# EAGLE design OPEN_SPECTRO_PI_HAT (EAGLE 9.7.0)
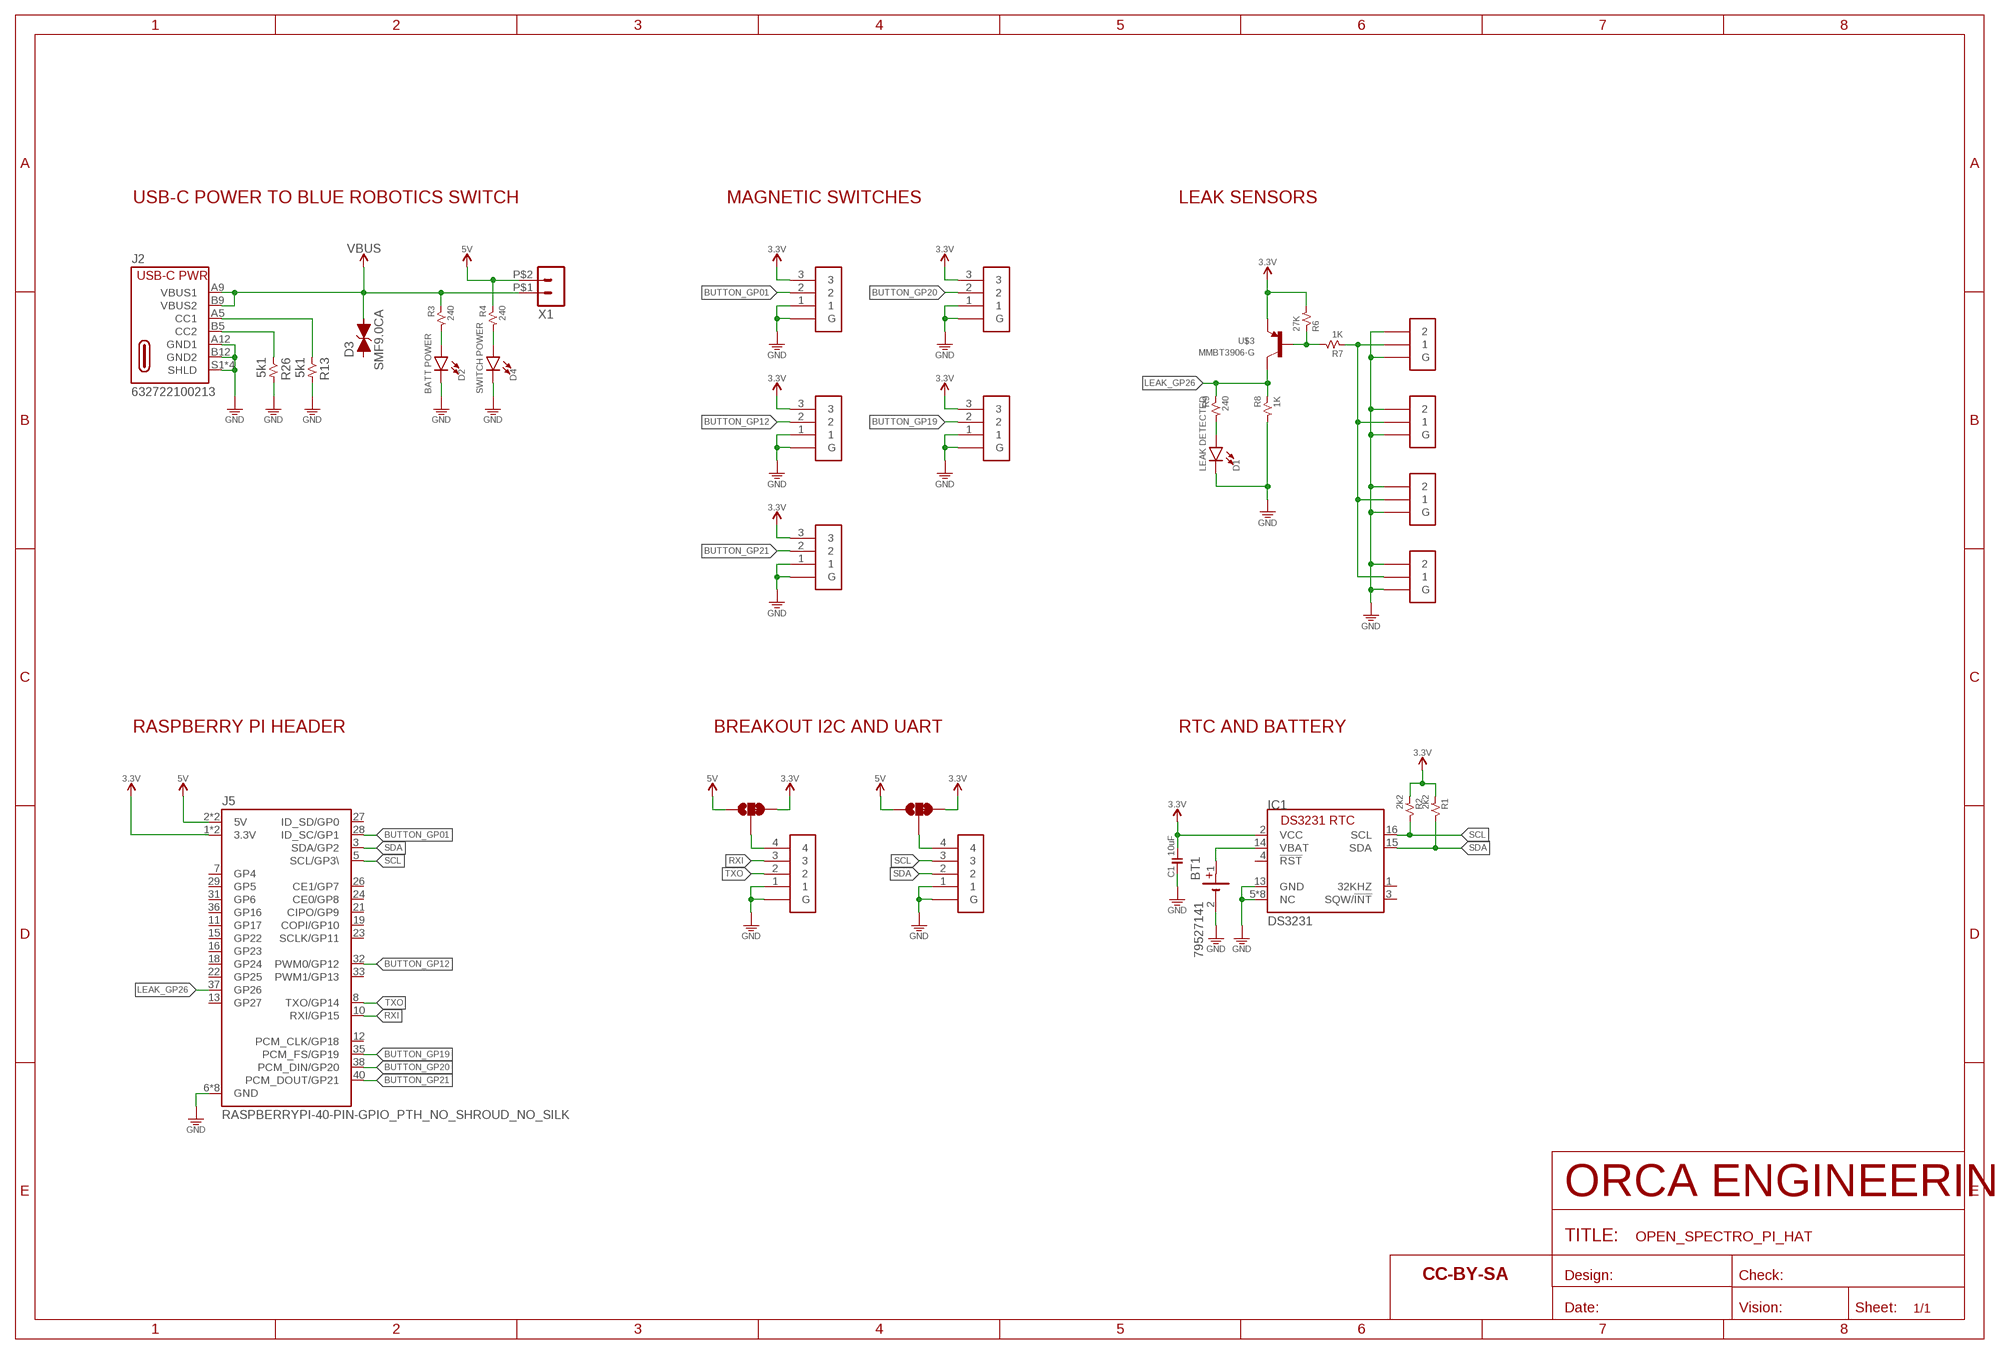
[diagram p0: schematic, sheet 1]

## Parts
BT1  79527141  [79527141]
C1  10uF  0805  [0805]
D1  LEAK DETECTED  LED0805  [0805_LED]
D2  BATT POWER  LED0805  [0805_LED]
D3  SMF9.0CA  DIODE-TVS-BIDIRECTIONALSMF18CA  [SOD-123F-TVS]
D4  SWITCH POWER  LED0805  [0805_LED]
IC1  DS3231/SO  [SO16W]
J2  632722100213  USB-C_PWR_6_PIN  [632722100213]
J5  RASPBERRYPI-40-PIN-GPIO_PTH_NO_SHROUD_NO_SILK  [2X20_NOSILK]
JP1  JUMPER-SMT_3_1-NC_TRACE_SILK  [SMT-JUMPER_3_1-NC_TRACE_SILK]
JP2  JUMPER-SMT_3_1-NC_TRACE_SILK  [SMT-JUMPER_3_1-NC_TRACE_SILK]
R1  2k2  0805  [0805]
R2  2k2  0805  [0805]
R3  240  0805  [0805]
R4  240  0805  [0805]
R6  27K  0805  [0805]
R7  1K  0805  [0805]
R8  1K  0805  [0805]
R9  240  0805  [0805]
R13  5k1  0805  [0805]
R26  5k1  0805  [0805]
U$1  JST-GH-2SIDE  [JST-GH-SIDE-2]
U$2  JST-GH-2SIDE  [JST-GH-SIDE-2]
U$3  MMBT3906-G  TRANS_PNPMMBT3906-G  [SOT23-3_GENERIC]
U$4  JST-GH-3SIDE  [JST-GH-SIDE-3]
U$5  JST-GH-2SIDE  [JST-GH-SIDE-2]
U$6  JST-GH-2SIDE  [JST-GH-SIDE-2]
U$7  JST-GH-4SIDE  [JST-GH-SIDE-4]
U$8  JST-GH-4SIDE  [JST-GH-SIDE-4]
U$11  JST-GH-3SIDE  [JST-GH-SIDE-3]
U$12  JST-GH-3SIDE  [JST-GH-SIDE-3]
U$14  JST-GH-3SIDE  [JST-GH-SIDE-3]
U$15  JST-GH-3SIDE  [JST-GH-SIDE-3]
X1  MICRO-FIT_02P43650-0200  [43650-0200]

## Nets
3.3V: C1.1 IC1.2(VCC) J5.1(3.3V) J5.17(3.3V) JP1.3 JP2.3 R1.2 R2.2 R6.2 U$3.3(C) U$4.3 U$11.3 U$12.3 U$14.3 U$15.3
5V: J5.2(5V) J5.4(5V) JP1.1 JP2.1 R4.1 X1.P$2
BATT_LED: D2.A R3.2
BUTTON_GP01: J5.28(ID_SC/GP1) U$4.2
BUTTON_GP12: J5.32(PWM0/GP12) U$11.2
BUTTON_GP19: J5.35(PCM_FS/GP19) U$15.2
BUTTON_GP20: J5.38(PCM_DIN/GP20) U$14.2
BUTTON_GP21: J5.40(PCM_DOUT/GP21) U$12.2
CC1: J2.A5(CC1) R13.1
CC2: J2.B5(CC2) R26.1
GND: BT1.2(-) C1.2 D1.C D2.C D4.C IC1.5(NC) IC1.6(NC) IC1.7(NC) IC1.8(NC) IC1.9(NC) IC1.10(NC) IC1.11(NC) IC1.12(NC) IC1.13(GND) J2.A12(GND1) J2.B12(GND2) J2.S1(SHLD) J2.S2(SHLD) J2.S3(SHLD) J2.S4(SHLD) J5.6(GND) J5.9(GND) J5.14(GND) J5.20(GND) J5.25(GND) J5.30(GND) J5.34(GND) J5.39(GND) R8.2 R13.2 R26.2 U$1.2 U$1.MECH1(G) U$1.MECH2(G) U$2.2 U$2.MECH1(G) U$2.MECH2(G) U$4.1 U$4.MECH1(G) U$4.MECH2(G) U$5.2 U$5.MECH1(G) U$5.MECH2(G) U$6.2 U$6.MECH1(G) U$6.MECH2(G) U$7.1 U$7.MECH1(G) U$7.MECH2(G) U$8.1 U$8.MECH1(G) U$8.MECH2(G) U$11.1 U$11.MECH1(G) U$11.MECH2(G) U$12.1 U$12.MECH1(G) U$12.MECH2(G) U$14.1 U$14.MECH1(G) U$14.MECH2(G) U$15.1 U$15.MECH1(G) U$15.MECH2(G)
LEAK_GP26: J5.37(GP26) R8.1 R9.1 U$3.2(E)
LEAK_SEN: R7.2 U$1.1 U$2.1 U$5.1 U$6.1
LK_BASE: R6.1 R7.1 U$3.1(B)
LK_LED: D1.A R9.2
N$1: JP1.2 U$7.4
N$2: JP2.2 U$8.4
N$7: D4.A R4.2
RTC_BATT: BT1.1(+) IC1.14(VBAT)
RXI: J5.10(RXI/GP15) U$8.3
SCL: IC1.16(SCL) J5.5(SCL/GP3\) R2.1 U$7.3
SDA: IC1.15(SDA) J5.3(SDA/GP2) R1.1 U$7.2
TXO: J5.8(TXO/GP14) U$8.2
V_USB: D3.C(C2) J2.A9(VBUS1) J2.B9(VBUS2) R3.1 X1.P$1 ; supply symbol labelled VBUS
Unconnected: D3.A(C1) IC1.1(32KHZ) IC1.3(SQW/!INT) IC1.4(!RST) J5.7(GP4) J5.11(GP17) J5.12(PCM_CLK/GP18) J5.13(GP27) J5.15(GP22) J5.16(GP23) J5.18(GP24) J5.19(COPI/GP10) J5.21(CIPO/GP9) J5.22(GP25) J5.23(SCLK/GP11) J5.24(CE0/GP8) J5.26(CE1/GP7) J5.27(ID_SD/GP0) J5.29(GP5) J5.31(GP6) J5.33(PWM1/GP13) J5.36(GP16)

## Notes on the sheet
- USB-C POWER TO BLUE ROBOTICS SWITCH | MAGNETIC SWITCHES | LEAK SENSORS
- RASPBERRY PI HEADER | BREAKOUT I2C AND UART | RTC AND BATTERY

## Library data of the parts
BT1 = Battery Holder:79527141: BATTERY HOLDER COIN 20MM SMD Manufacturer's datasheet <https://katalog.we-online.de/em/datasheet/79527141.pdf>; CREATED_BY: PCBLayout.com; DIGIKEY_PART_NO: 732-12325-2-ND; MANUFACTURER: Wurth Electronics Inc.; MPN: 79527141
C1 = _L_Capacitors:0805
D1 D2 D4 = _L_LED:LED: Blue SMD LED Used in manufacturing of various products at SparkFun Packages: 0603 - SMD 0603 package [Product Link] <http://www.digikey.com/product-detail/en/SMLE12BC7TT86/511-1589-2-ND/1641808> 1206 - SMD1206 package [Product Link] <http://www.digikey.com/product-detail/en/lite-on-inc/LTST-C150TBKT/160-1643-1-ND/573584> SparkFun Products: ESP8266 Thing-Dev Board <https://www.sparkfun.com/products/13711> RedBoard <https://www.sparkfun.com/products/12757>
D3 = _L_Diodes:DIODE-TVS-BIDIRECTIONAL
IC1 = _L_Crystals:DS3231
J2 = _LSR_PSU.ed30ee56-a72f-4025-ba07-50062280f7a7.flbr:USB-C_PWR_6_PIN: WR-COM USB Power Delivery Type C Receptacle Horizontal SMT General Information Operating Temperature -40 °C up to +85 °C Durability 10 000 Mating cycles Gender Receptacle Type Horizontal Electrical Properties Working Voltage 48 V (DC) Withstanding Voltage 100 V (AC) Contact Resistance 40 mΩ Material Properties Insulator Material LCP Insulator Flammability Rating UL94 V-0 Insulator Color Black Contact Material Brass Contact Plating Selective Gold Shielding Material Steel Shielding Plating Nickel <https://www.we-online.com/catalog/media/o785209v209%20Multi-WR-USB31-632722100213.jpg> Details see: www.we-online.com/en/components/products/WR_COM_USB_POWER_DELIVERY_TYPE_C_RECEPTACLE_HORIZONTAL_SMT <www.we-online.com/catalog/WR_COM_USB_POWER_DELIVERY_TYPE_C_RECEPTACLE_HORIZONTAL_SMT/?utm_source=eagle_model&utm_medium=description_link&utm_campaign=eisos_eagle> Created by Ella Wu 2024-03-08 2024 (C) Würth Elektronik; APPLICATION: USB Power Delivery; DATASHEET-URL: https://www.we-online.com/redexpert/spec/632722100213?ae; GERDER: Receptacle; INTERFACE-TYPE: Type C; IR: 5A; MOUNT: SMT; PACKAGING: Tape and Reel; PART-NUMBER: 632722100213; PINS: 6; TYPE: Horizontal; WORKING-VOLTAGE: 48V(DC)
J5 = SparkFun-Connectors:RASPBERRYPI-40-PIN-GPIO: Raspberry Pi GPIO Header 2x20 pin connector, as found on B, B+, A+ models. Both shrouded PTH and SMT versions available. SparkFun Products: GPIO Shrouded Header <https://www.sparkfun.com/products/13054>- PTH SparkFun Pi Wedge (Preassembled) <https://www.sparkfun.com/products/13717>
JP1 JP2 = SparkFun-Jumpers:JUMPER-SMT_3_1-NC_TRACE: Normally closed trace jumper (1 of 2 connections) This jumper has a trace between two pads so it's normally closed (NC). The other connection is normally open (NO). Use a razor knife to open the connection. For best results follow the IPC guidelines for cutting traces: Cutout at least 0.063 mm (0.005 in). Remove all loose material to clean up the cut area. Seal the cut with an approved epoxy. Reapply solder to reclose the connection, or to close the NO connection.
R1-R4 R6-R9 R13 R26 = _L_Resistors:0805
U$1 U$2 U$5 U$6 = _L_Connectors:JST-GH-2
U$3 = _L_Mosfets:TRANS_PNP
U$4 U$11 U$12 U$14 U$15 = _L_Connectors:JST-GH-3
U$7 U$8 = _L_Connectors:JST-GH-4
X1 = _L_Connectors:MICRO-FIT_02P: Molex - Micro-Fit 3.0 Series connector, 3.00mm (0.118") pitch header, 2 positions.

## Board
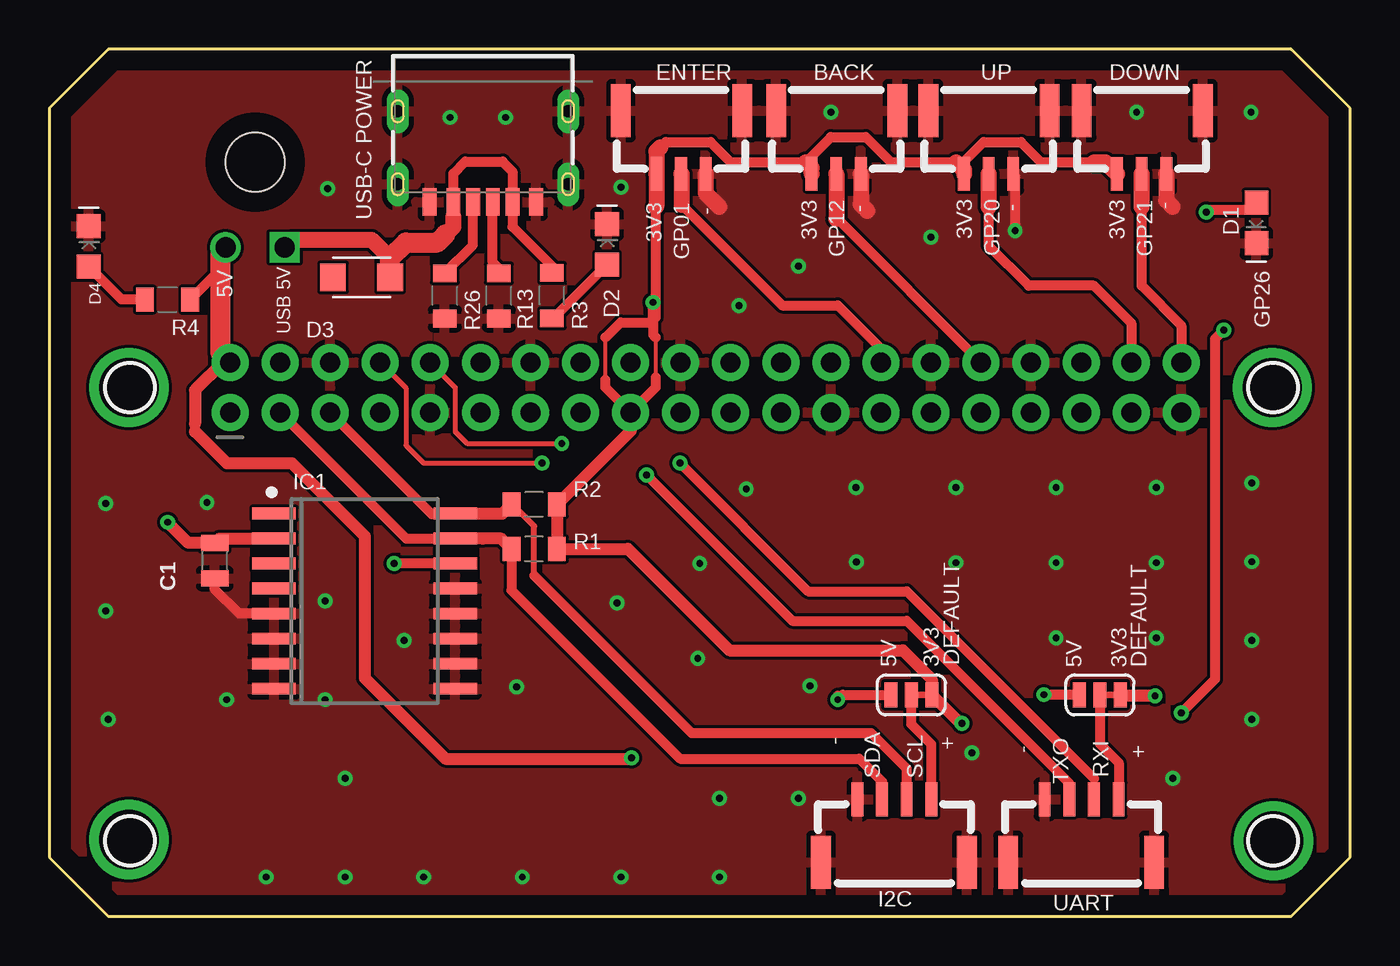
[diagram p1: board, top side]
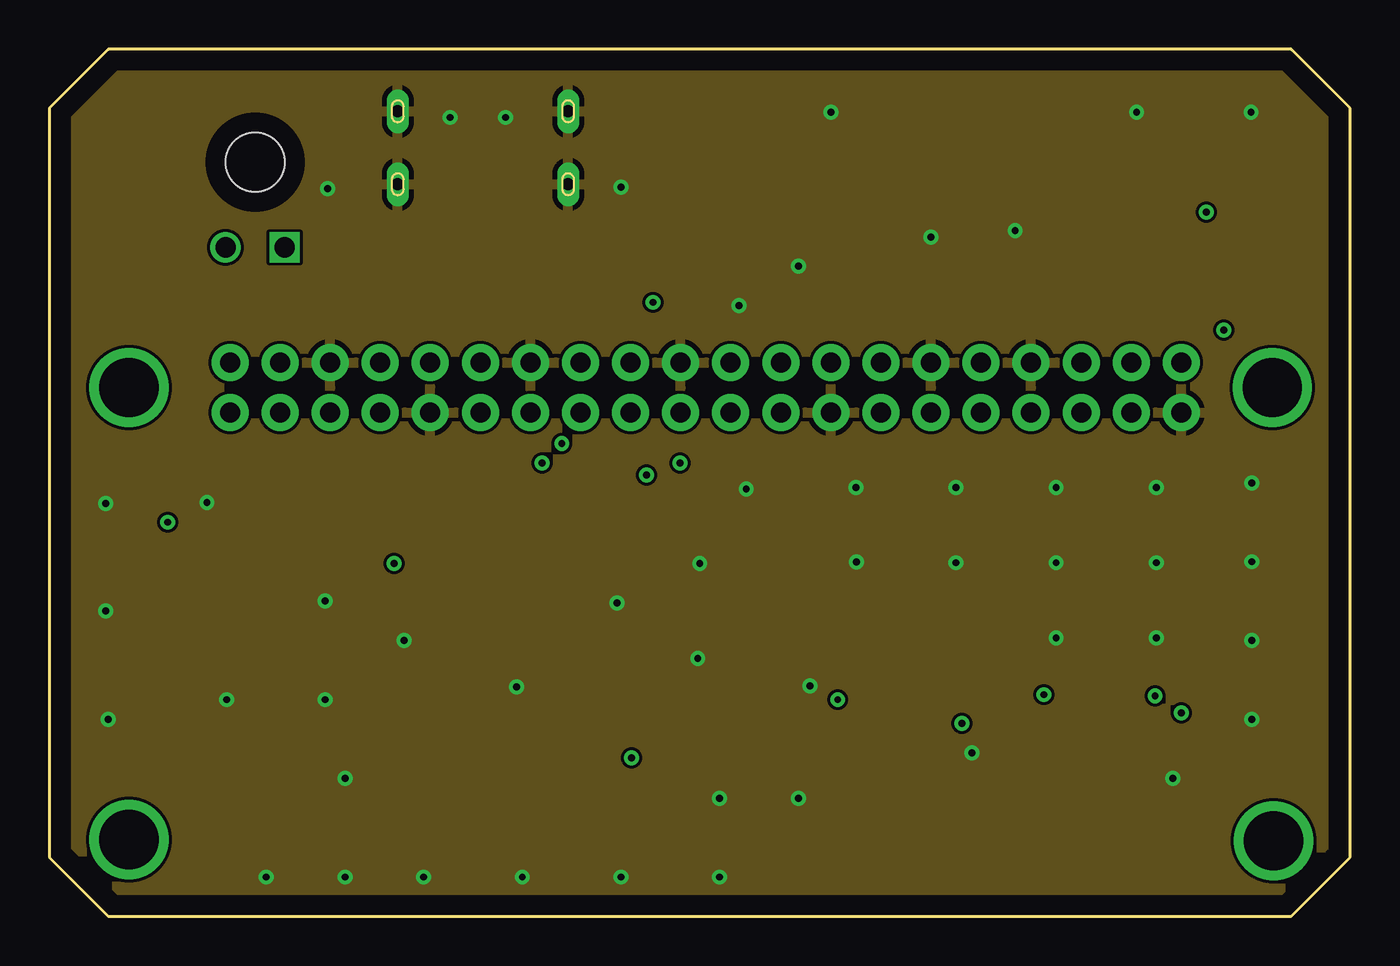
[diagram p2: board, inner layer Route2]
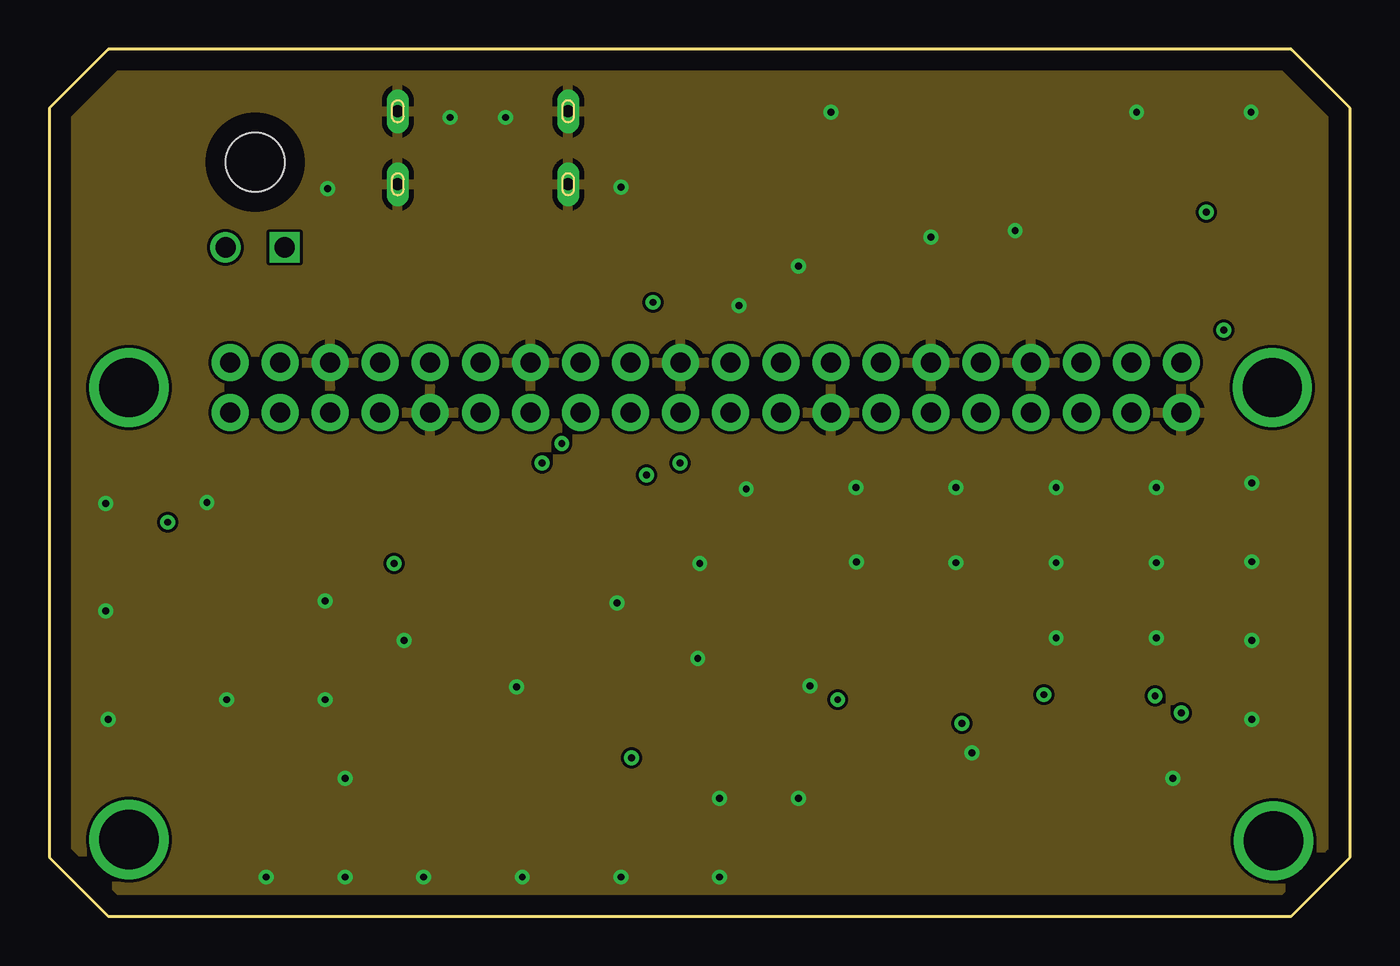
[diagram p3: board, inner layer Route15]
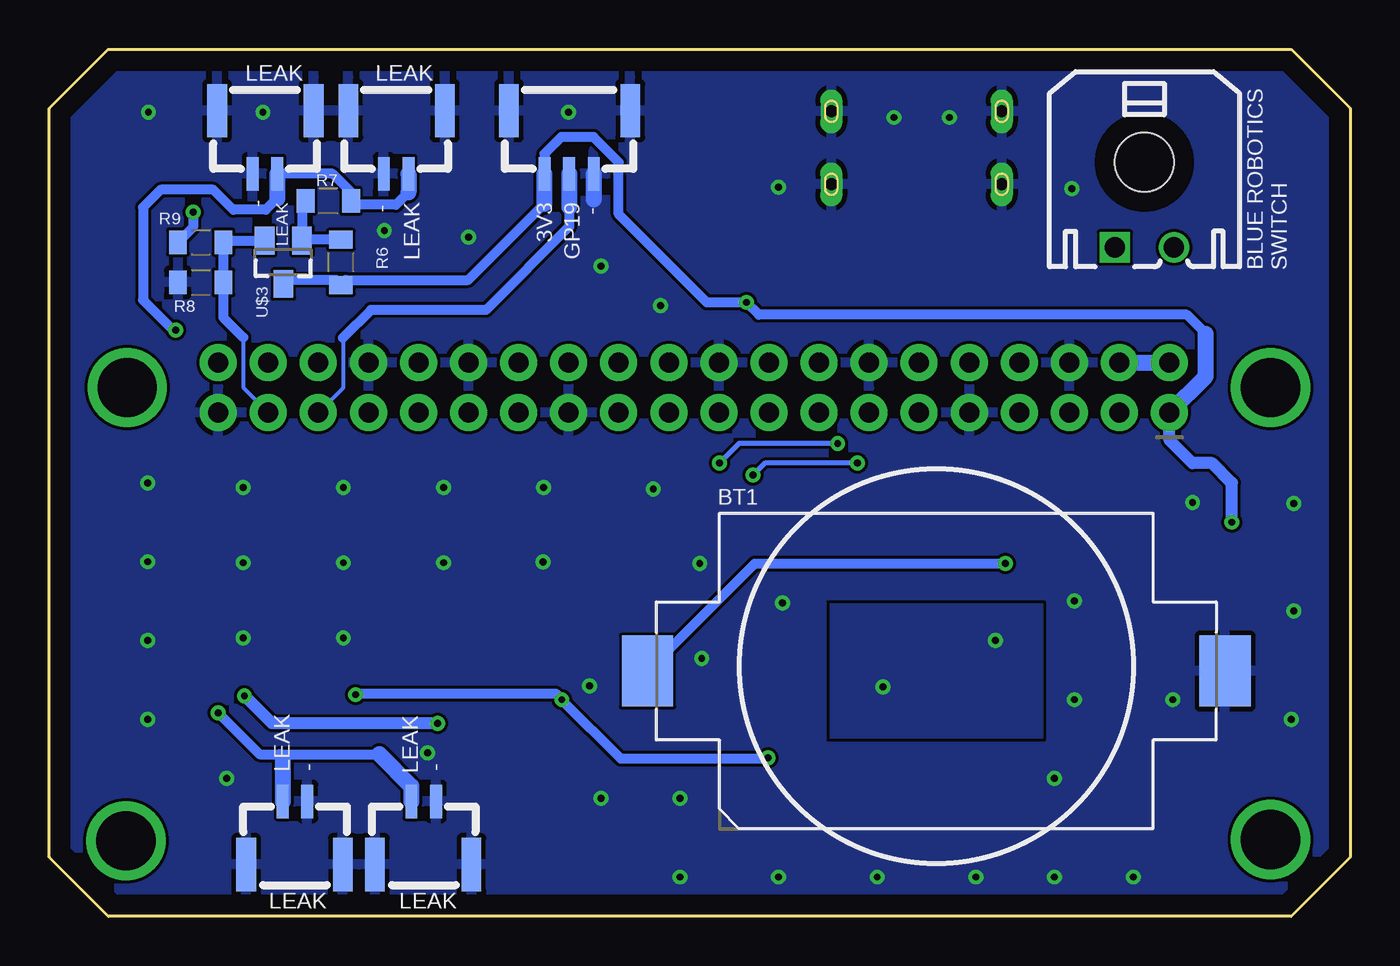
[diagram p4: board, bottom side, seen from below]

Size 66 x 44 mm. Coordinates in mm from the lower left corner, seen from the top.
Outline: 0,3 3,0 63,0 66,3 66,41 63,44 3,44 0,41 0,3
Copper layers (1+2*15+16): Top 0.035mm / dielectric 1.5mm / Route2 0.035mm / dielectric 0.15mm / Route15 0.035mm / dielectric 0.2mm / Bottom 0.035mm
Design rules "Fusion Electronics Design Rules *": minimum track width 6mil, minimum drill 0.35mm, track to track 6mil, track to pad 6mil, pad to pad 6mil, via to via 6mil, smd to smd 6mil, copper to edge 40mil, drill to drill 6mil, minimum pad ring 10mil, minimum via ring 8mil, stop-mask expansion 4mil, vias tented up to drill 0mil, thermal gap 10mil

### Footprints (pad centres in the part's own frame; a part is rotated, then mirrored left to right if it is on the bottom)
79527141 = smd 2.6 x 3.6: 1 -14.65,0; 2 14.65,0
0805 = smd 0.8 x 1.4: 1 -0.9,0; 2 0.9,0
0805_LED = smd 1.2 x 1.2: A -1.027,0; C 1.027,0
SOD-123F-TVS = smd 1.3 x 1.4: A -1.45,0; C 1.45,0
SO16W = smd 0.6 x 2.2: 1 -4.445,-4.6; 2 -3.175,-4.6; 3 -1.905,-4.6; 4 -0.635,-4.6; 5 0.635,-4.6; 6 1.905,-4.6; 7 3.175,-4.6; 8 4.445,-4.6; 9 4.445,4.6; 10 3.175,4.6; 11 1.905,4.6; 12 0.635,4.6; 13 -0.635,4.6; 14 -1.905,4.6; 15 -3.175,4.6; 16 -4.445,4.6
632722100213 = smd 0.7 x 1.4: A5 -0.5,2.75; A9 1.5,2.75; A12 2.7,2.75; B5 0.5,2.75; B9 -1.5,2.75; B12 -2.7,2.75 | drill 0.6 pad 0.7 long: S1 -4.32,1.85; S2 4.32,1.85; S3 4.32,-1.85; S4 -4.32,-1.85
2X20_NOSILK = drill 1.016 pad 1.88: 1 0,0; 2 0,2.54; 3 2.54,0; 4 2.54,2.54; 5 5.08,0; 6 5.08,2.54; 7 7.62,0; 8 7.62,2.54; 9 10.16,0; 10 10.16,2.54; 11 12.7,0; 12 12.7,2.54; 13 15.24,0; 14 15.24,2.54; 15 17.78,0; 16 17.78,2.54; 17 20.32,0; 18 20.32,2.54; 19 22.86,0; 20 22.86,2.54; 21 25.4,0; 22 25.4,2.54; 23 27.94,0; 24 27.94,2.54; 25 30.48,0; 26 30.48,2.54; 27 33.02,0; 28 33.02,2.54; 29 35.56,0; 30 35.56,2.54; 31 38.1,0; 32 38.1,2.54; 33 40.64,0; 34 40.64,2.54; 35 43.18,0; 36 43.18,2.54; 37 45.72,0; 38 45.72,2.54; 39 48.26,0; 40 48.26,2.54
SMT-JUMPER_3_1-NC_TRACE_SILK = smd 0.66 x 1.27: 1 -1.041,0; 2 0,0; 3 1.041,0
0805' = smd 0.9 x 1.2: 1 -1.15,0; 2 1.15,0
JST-GH-SIDE-2 = smd 0.6 x 1.7: 1 0,0; 2 1.25,0 | smd 1 x 2.7: MECH1 3.05,-3.2; MECH2 -1.85,-3.2
SOT23-3_GENERIC = smd 1 x 1.4: 1 -0.95,-1.1; 2 0.95,-1.1; 3 0,1.1
JST-GH-SIDE-3 = smd 0.6 x 1.7: 1 0,0; 2 1.25,0; 3 2.5,0 | smd 1 x 2.7: MECH1 4.3,-3.2; MECH2 -1.85,-3.2
JST-GH-SIDE-4 = smd 0.6 x 1.7: 1 0,0; 2 1.25,0; 3 2.5,0; 4 3.75,0 | smd 1 x 2.7: MECH1 5.55,-3.2; MECH2 -1.85,-3.2
43650-0200 = drill 1.02 square: P$1 1.5,4.32 | drill 1.02: P$2 -1.5,4.32 | hole 3: 0,0

### Placement (x,y rotation side)
BT1  21,12.46 0 bottom
C1  8.4,18.05 270 top
D1  61.24,35.19 270 top
D2  28.3,34.1 90 top
D3  15.84,32.43 0 top
D4  2,34 90 top
IC1  16,16 270 top
J2  22,39 180 top
J5  9.17,25.57 0 top
JP1  43.73,11.25 0 top
JP2  53.3,11.25 0 top
R1  2k2  [0805']  24.6,18.65 0 top
R2  2k2  [0805']  24.6,20.9 0 top
R3  240  [0805']  25.5,31.5 270 top
R4  240  [0805']  6,31.3 180 top
R6  27K  [0805']  51.21,33.19 270 bottom
R7  1K  [0805']  51.84,36.3 0 bottom
R8  1K  [0805']  58.32,32.17 180 bottom
R9  240  [0805']  58.32,34.21 180 bottom
R13  5k1  [0805']  22.8,31.48 270 top
R26  5k1  [0805']  20.07,31.48 270 top
U$1  47.78,37.68 180 bottom
U$2  54.43,37.68 180 bottom
U$3  54.13,33.19 180 bottom
U$4  33.3,37.68 180 top
U$5  54.16,5.84 0 bottom
U$6  47.63,5.84 0 bottom
U$7  41,5.94 0 top
U$8  50.5,5.94 0 top
U$11  41.17,37.68 180 top
U$12  56.67,37.68 180 top
U$14  48.9,37.68 180 top
U$15  38.38,37.68 180 bottom
X1  10.44,38.27 180 bottom

### Tracks (layer width: path | path; a pad name or v marks a point on that pad's centre or on a via)
3.3V  (via drill 0.35)
  Top 0.2: 28.22,27.22 28.22,29.38 | 30.76,29.38 30.76,27.35
  Top 0.508: 30.76,27.35 30.76,26.84 J5.17 28.22,26.84 28.22,27.22 | 30.63,30.27 v30.63,31.16 30.63,29.51 30.76,29.38 | 30.76,36 30.76,30.4 30.63,30.27 | 28.22,29.38 28.98,30.14 30.51,30.14 30.63,30.27 | 30.99,39.01 31.27,39.29 33.55,39.29 34.57,38.27 38.38,38.27 39.65,39.54 41.43,39.54 42.7,38.27 46,38.27 46.38,38.27 | 46.38,38.27 47.4,39.29 49.3,39.29 50.32,38.27 53,38.27 | U$14.3 46.38,37.71 46.38,38.27
  Top 0.61: IC1.2 8.62,19.18 C1.1 7.05,18.95 v6,20 | J5.17 29.49,24.64 R2.2 R1.2 29.35,18.65 34.5,13.5 43.3,13.5 44.78,12.02 JP1.3 46.22,9.8 v46.3,9.8 | v56.1,11.2 54.39,11.2 JP2.3
  Top 0.813: 30.76,36 30.8,36.04 U$4.3 30.8,38.82 30.99,39.01 | U$12.3 53.58,38.27 53,38.27 | U$14.3 46.4,37.87 46,38.27 | U$11.3 38.67,37.98 38.38,38.27
  Bottom 0.508: 7.34,29.57 8.3,30.53 30.01,30.53 v30.63,31.16 32.63,31.16 37.11,35.64 37.11,38.27 38.38,39.54 40.03,39.54 40.88,38.69 U$15.3 | U$3.3 53.92,32.29 51.46,32.29 R6.2 50.95,32.29 44.75,32.29 40.88,36.16
  Bottom 0.61: v6,20 6,22 7,23 8,23 9.17,24.17 J5.1 | v46.3,9.8 54.7,9.8 v56.1,11.2
  Bottom 0.813: 40.88,36.16 U$15.3 | J5.1 7.34,27.4 7.34,29.57
5V  (via drill 0.35)
  Top 0.508: JP1.1 40.26,11.25 40.3,11.2 40,11.2 v40,11 | JP2.1 50.47,11.25 v50.45,11.25 | R4.1 8.69,32.84 8.69,33.7 | 7.4,24.6 7.4,25
  Top 0.61: J5.2 8.81,28.11 7.4,26.7 7.4,25 | 7.4,24.6 9,23 12.3,23 16,19.3 16,12.1 20.1,8 29.5,8 v29.55,8.04
  Top 1.016: X1.P$2 8.69,33.7 8.69,28.59 J5.2
  Bottom 0.508: v50.45,11.25 50.41,11.3 40.3,11.3 v40,11 37,8 29.59,8 v29.55,8.04
  Bottom 0.813: J5.4 J5.2
BATT_LED
  Top 0.508: R3.2 25.58,30.35 D2.A
BUTTON_GP01
  Top 0.508: 32.09,36.1 37.19,31 40,31 42.19,28.81 J5.28
  Top 0.813: U$4.2 32.09,37.65 32.09,36.1
BUTTON_GP12
  Top 0.508: J5.32 39.98,35.4 39.92,35.4
  Top 0.813: U$11.2 39.92,35.4
BUTTON_GP19
  Bottom 0.2: 51.1,29.36 51.1,26.82 J5.35
  Bottom 0.508: 39.63,36 39.63,34.99 43.84,30.78 49.68,30.78 51.1,29.36
  Bottom 0.813: U$15.2 39.63,36
BUTTON_GP20
  Top 0.508: J5.38 54.89,30.11 53,32 49.69,32 47.65,34.04 47.65,36
  Top 0.813: U$14.2 47.65,36
BUTTON_GP21
  Top 0.508: 55.42,36 55.42,32 57.43,29.99 J5.40
  Top 0.813: 55.42,36 U$12.2
CC1
  Top 0.508: R13.1 22.8,32.89 22.5,33.2 J2.A5
CC2
  Top 0.508: J2.B5 21.5,34.07 R26.1
GND  (via drill 0.35)
  Top 0.508: IC1.5 9.63,15.37 8.4,16.6 C1.2 | U$14.1 49,37.59 v49,34.8
  Top 0.813: U$11.1 41.17,36.13 41.5,35.8 | U$4.1 33.3,36.7 34,36 | U$12.1 56.67,36.33 57,36 | 14.39,28.25 J5.6
  Bottom 0.813: U$15.1 38.38,36.38
  other vias: 39.65,40.81 55.16,40.81 40.95,17.98 23.71,11.64 23.14,40.54 44.73,34.46 60.97,40.81 56.16,21.76 51.08,21.76 46,21.76 40.92,21.76 46,17.95 51.08,17.95 56.16,17.95 56.16,14.14 51.08,14.14 2.86,20.96 35.36,21.68 2.86,15.5 14,11 9,11 8,21 28.8,15.9 32.9,13.1 38,6 34,6 34,2 29,2 24,2 15,2 11,2 15,7 14,16 29,37 38,33 57,7 38.6,11.7 33,17.9 18,14 20.33,40.54 46.8,8.29 61,22 61,18 61,14 61,10 3,10 35,31 19,2 14.13,36.92
  pour Top: -4.55,-4.66 69.88,-4.66 69.88,46.91 -4.55,46.91
  pour Route15: -5.82,-3.39 68.61,-3.39 68.61,48.18 -5.82,48.18
  pour Route2: -6.82,-2.39 67.61,-2.39 67.61,49.18 -6.82,49.18
  pour Bottom: -7.82,-1.39 66.61,-1.39 66.61,50.18 -7.82,50.18
LEAK_GP26
  Bottom 0.2: 56.16,29.38 56.16,26.84 J5.37
  Bottom 0.508: U$3.2 57.09,34.29 R9.1 R8.1 57.17,30.39 56.16,29.38
LEAK_SEN  (via drill 0.35)
  Top 0.508: v57.43,10.33 59.13,12.04 59.13,29.3 v59.59,29.76
  Bottom 0.508: v57.43,10.33 55.33,8.23 54.33,8.23 | 54.33,8.23 54.16,8.06 | 54.33,8.23 49.25,8.23 | 47.78,36.75 48.41,36.11 50.5,36.11 R7.2 50.69,36.74 51.64,37.68 U$2.1 | 54.43,36.44 55.02,35.86 56.67,35.86 57.68,36.87 60.35,36.87 61.24,35.98 61.24,31.28 59.68,29.72 59.63,29.72 v59.59,29.76
  Bottom 0.813: U$6.1 47.63,6.61 49.25,8.23 | 54.16,8.06 U$5.1 | U$2.1 54.43,36.44 | U$1.1 47.78,36.75
LK_BASE
  Bottom 0.508: R7.1 53.18,36.12 U$3.1 53.13,34.34 R6.1
LK_LED  (via drill 0.35)
  Top 0.508: v58.7,35.73 58.83,35.86 60.88,35.86 D1.A
  Bottom 0.508: v58.7,35.73 58.7,34.98 R9.2
N$1
  Top 0.508: U$7.4 44.75,8.73 43.73,9.75 JP1.2
N$2
  Top 0.508: U$8.4 54.25,7.8 53.3,8.75 JP2.2
N$3  (via drill 3)
  other vias: 62.05,26.84
N$4  (via drill 3)
  other vias: 4.04,26.84
N$5  (via drill 3)
  other vias: 4.04,3.9
N$6  (via drill 3)
  other vias: 62.11,3.84
N$7
  Top 0.508: R4.2 3.67,31.3 D4.A
RTC_BATT  (via drill 0.35)
  Top 0.508: IC1.14 v17.51,17.91 v17.5,17.9
  Bottom 0.508: v17.5,17.9 17.51,17.89 30.22,17.89 BT1.1
RXI  (via drill 0.35)
  Top 0.254: J5.10 20.6,26.84 20.6,24.6 21.2,24 v26,24 | 53,7 U$8.3
  Top 0.508: v32,23 38.5,16.5 43.5,16.5 53,7
  Bottom 0.254: v26,24 31,24 v32,23
SCL
  Top 0.305: 24.6,17.3 24.6,19.8 23.5,20.9
  Top 0.508: U$7.3 43.5,7.5 41.7,9.3 32.6,9.3 24.6,17.3 | 23.5,20.9 R2.1 | J5.5 19.42,20.4 20.55,20.4 IC1.16
  Top 0.61: IC1.16 23,20.45 R2.1
SDA
  Top 0.508: U$7.2 42.25,6.85 41.1,8 32,8 23.45,16.55 R1.1 | J5.3 18.11,19.18 22,19.18
  Top 0.61: R1.1 22.92,19.18 22,19.18 IC1.15
TXO  (via drill 0.35)
  Top 0.254: J5.8 18.1,26.8 18.1,23.9 19,23 v25,23 | 51.75,6.75 U$8.2
  Top 0.508: v30.3,22.4 37.7,15 43.5,15 51.75,6.75
  Bottom 0.254: v25,23 29.7,23 v30.3,22.4
V_USB
  Top 0.508: 20.5,35.5 J2.A9 20.5,37.7 21.1,38.3 23,38.3 23.5,37.8 J2.B9 23.5,35 25.5,33 R3.1 | 19.7,34.2 19.75,34.25
  Top 0.813: 20.5,35.5 20.5,35 20.1,34.6 | 17.29,33.39 16.35,34.34 12.32,34.34 X1.P$1
  Top 1.016: D3.C 17.29,33.39 18.1,34.2 19.7,34.2 | 19.75,34.25 20.1,34.6

### Text on the board
tPlace: ENTER | BACK | UP | DOWN | 3V3 | GP01 | - | 3V3 | GP12 | - | 3V3 | GP20 | - | 3V3 | GP21 | - | USB-C POWER | GP26 | 5V | USB 5V | 5V | 3V3 | DEFAULT | 5V | 3V3 | DEFAULT | - | SDA | SCL | + | TXO | RXI | + | - | I2C | UART
bPlace: LEAK | LEAK | - | GP19 | 3V3 | LEAK | - | LEAK | - | BLUE ROBOTICS / SWITCH | - | LEAK | - | LEAK | LEAK | LEAK